# EAGLE board panda-2 (EAGLE 9.6.2)
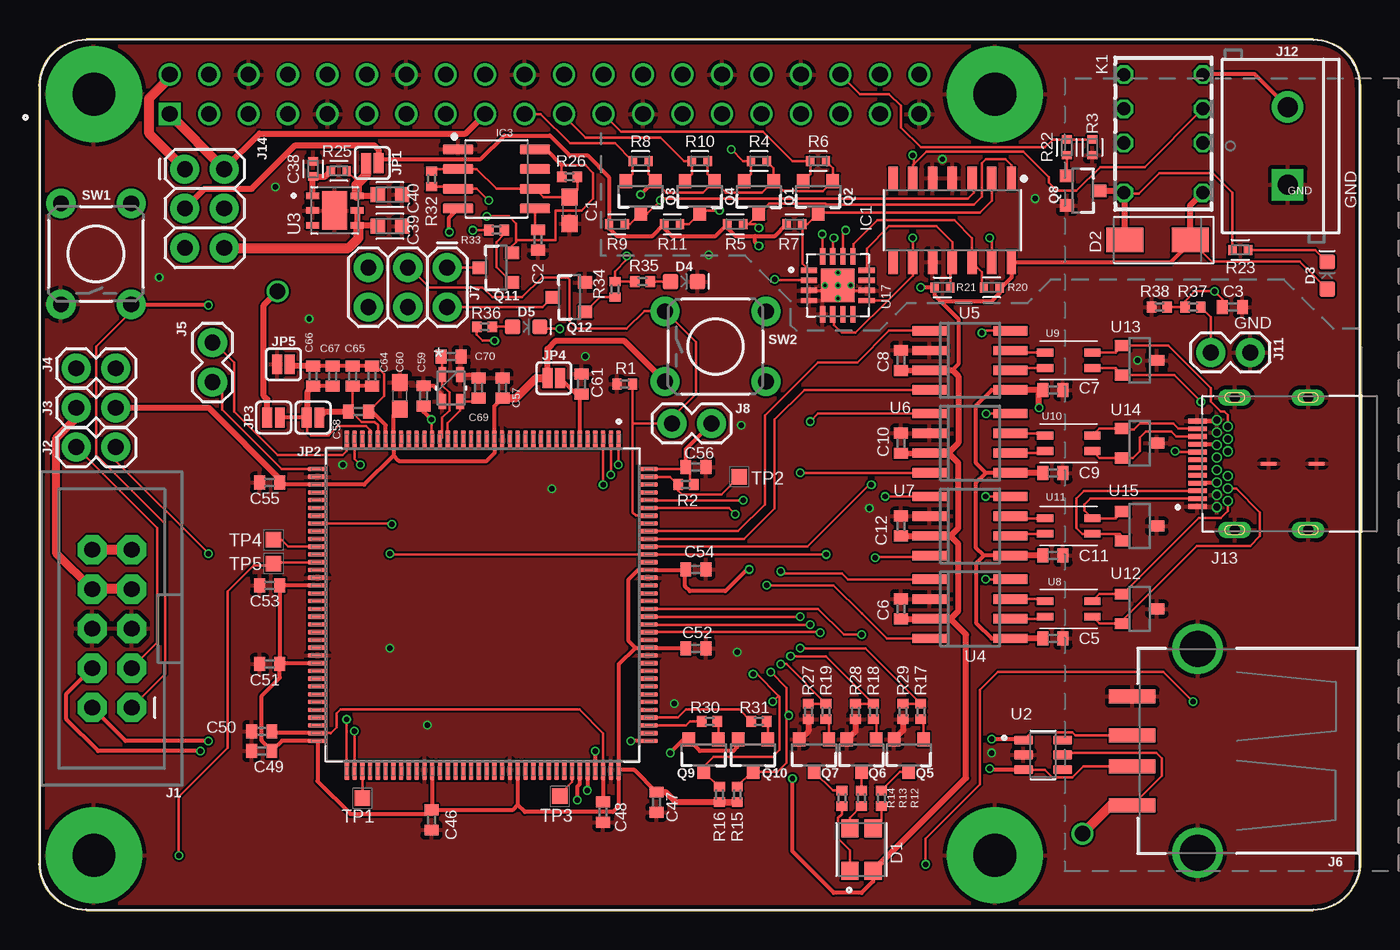
[diagram p3: board, top side]
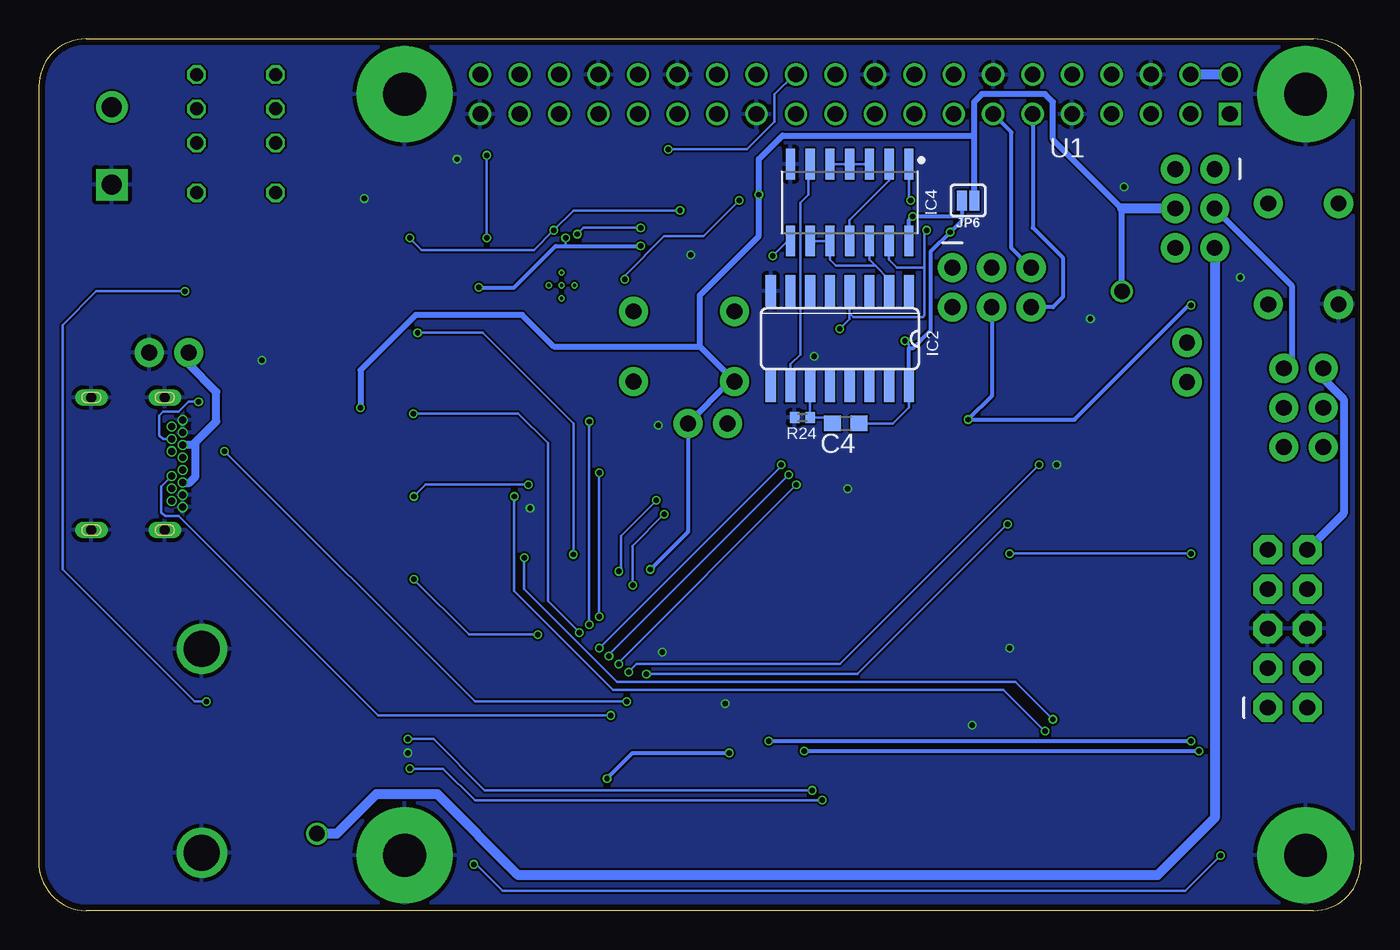
[diagram p4: board, bottom side, seen from below]

Size 85.09 x 56.13 mm. Coordinates in mm from the lower left corner, seen from the top.
Outline: 0,53.09 0,3.05 arc90 3.05,0 82.04,0 arc90 85.09,3.17 85.09,53.09 arc90 82.04,56.13 3.05,56.13 arc90 0,53.09
Copper layers (1*16): Top 0.035mm / dielectric 1.5mm / Bottom 0.035mm
Design rules "default *": minimum track width 6mil, minimum drill 0.1mm, track to track 5mil, track to pad 5mil, pad to pad 5mil, via to via 5mil, smd to smd 5mil, copper to edge 15mil, drill to drill 6mil, minimum pad ring 4mil, minimum via ring 4mil, stop-mask expansion 2mil, vias tented up to drill 0mil, thermal gap 10mil

## Footprints (pad centres in the part's own frame; a part is rotated, then mirrored left to right if it is on the bottom)
C0603 = smd 1.1 x 1: 1 -0.85,0; 2 0.85,0
C0402 = smd 0.7 x 0.9: 1 -0.65,0; 2 0.65,0
CAPC1005X60 = smd 0.56 x 0.629: 1 -0.485,0; 2 0.485,0
CAPC1608X85 = smd 0.921 x 0.97: 1 -0.775,0; 2 0.775,0
LED_CLV1A-FKB-CK1VW1DE1BB7C3C3 = smd 1.15 x 1.1: 1 -1.375,0.75; 2 -1.375,-0.75; 3 1.375,-0.75; 4 1.375,0.75
DIOM5226X290N = smd 2.392 x 1.565: 1 -2.108,0; 2 2.108,0
LED-0603 = smd 1 x 1: A -0.877,0; C 0.877,0
SOIC127P600X175-14N = smd 1.5 x 0.6: 1 -2.7,3.81; 2 -2.7,2.54; 3 -2.7,1.27; 4 -2.7,0; 5 -2.7,-1.27; 6 -2.7,-2.54; 7 -2.7,-3.81; 8 2.7,-3.81; 9 2.7,-2.54; 10 2.7,-1.27; 11 2.7,0; 12 2.7,1.27; 13 2.7,2.54; 14 2.7,3.81
SO16 = smd 0.66 x 2.032: 1 -4.445,-3.073; 2 -3.175,-3.073; 3 -1.905,-3.073; 4 -0.635,-3.073; 5 0.635,-3.073; 6 1.905,-3.073; 7 3.175,-3.073; 8 4.445,-3.073; 9 4.445,3.073; 10 3.175,3.073; 11 1.905,3.073; 12 0.635,3.073; 13 -0.635,3.073; 14 -1.905,3.073; 15 -3.175,3.073; 16 -4.445,3.073
SOIC127P599X175-8N = smd 1.965 x 0.602: 1 -2.47,1.905; 2 -2.47,0.635; 3 -2.47,-0.635; 4 -2.47,-1.905; 5 2.47,-1.905; 6 2.47,-0.635; 7 2.47,0.635; 8 2.47,1.905
SOIC127P600X175-14N' = smd 1.968 x 0.599: 1 -2.473,3.81; 2 -2.473,2.54; 3 -2.473,1.27; 4 -2.473,0; 5 -2.473,-1.27; 6 -2.473,-2.54; 7 -2.473,-3.81; 8 2.473,-3.81; 9 2.473,-2.54; 10 2.473,-1.27; 11 2.473,0; 12 2.473,1.27; 13 2.473,2.54; 14 2.473,3.81
2X5-SHROUDED-NS = drill 1.016 pad 1.88 octagon: 1 -1.27,5.08; 2 1.27,5.08; 3 -1.27,2.54; 4 1.27,2.54; 5 -1.27,0; 6 1.27,0; 7 -1.27,-2.54; 8 1.27,-2.54; 9 -1.27,-5.08; 10 1.27,-5.08
1X02 = drill 1.016 pad 1.88: 1 0,0; 2 2.54,0
USB-A-S-SILK-FEMALE = smd 3 x 0.9: D+ 7.212,-1; D- 7.212,1; GND 7.212,-3.5; VBUS 7.212,3.5 | drill 2.311: SHLD1 3,-6.566; SHLD2 3,6.566
2X3 = drill 1.016 pad 1.88: 1 0,0; 2 0,2.54; 3 2.54,0; 4 2.54,2.54; 5 5.08,0; 6 5.08,2.54
SCREWTERMINAL-5MM-2 = drill 1.3 pad 2.032 square: 1 0,0 | drill 1.3 pad 2.032: 2 5,0
BELFUSE_SS-52400-003 = smd 0.3 x 1.2: A1 -2.75,7.13; A2 -2.25,7.13; A3 -1.75,7.13; A4 -1.25,7.13; A5 -0.75,7.13; A6 -0.25,7.13; A7 0.25,7.13; A8 0.75,7.13; A9 1.25,7.13; A10 1.75,7.13; A11 2.25,7.13; A12 2.75,7.13 | drill 0.45 pad 0.65: B1 2.8,5.88; B2 2.4,5.17; B3 1.6,5.17; B4 1.2,5.88; B5 0.8,5.17; B6 0.4,5.88; B7 -0.4,5.88; B8 -0.8,5.17; B9 -1.2,5.88; B10 -1.6,5.17; B11 -2.4,5.17; B12 -2.8,5.88; G1 2,5.88; G2 -2,5.88 | smd 0.2 x 1: G3 0,2.55; G4 0,-0.55 | drill 0.65 pad 1.05 long: S1 -4.27,4.73; S2 4.27,4.73; S3 -4.27,0; S4 4.27,0
SMT-JUMPER_2_NC_PASTE_SILK = smd 0.635 x 1.27: 1 -0.406,0; 2 0.406,0
G6K-2P-Y = drill 0.85 octagon: 1 0,-2.54; 2 3.2,-2.54; 3 5.4,-2.54; 4 7.6,-2.54; 5 7.6,2.54; 6 5.4,2.54; 7 3.2,2.54; 8 0,2.54
SOT23-3 = smd 0.8 x 0.9: 1 -0.95,-1; 2 0.95,-1; 3 0,1.1
R0402 = smd 0.6 x 0.7: 1 -0.5,0; 2 0.5,0
RESC1005X40 = smd 0.535 x 0.644: 1 -0.507,0; 2 0.507,0
TACTILE_SWITCH_PTH_6.0MM = drill 1.016 pad 1.88: 1 -3.251,2.261; 2 3.251,2.261; 3 -3.251,-2.261; 4 3.251,-2.261
TESTPOINT_SMD-10SN = smd 1 x 1: TP 0,0
MODULE_RASPBERRYPI4_4GB = drill 1.016 square: 1 24.148,-1.256 | drill 1.016: 2 24.148,1.284; 3 21.608,-1.256; 4 21.608,1.284; 5 19.068,-1.256; 6 19.068,1.284; 7 16.528,-1.256; 8 16.528,1.284; 9 13.988,-1.256; 10 13.988,1.284; 11 11.448,-1.256; 12 11.448,1.284; 13 8.908,-1.256; 14 8.908,1.284; 15 6.368,-1.256; 16 6.368,1.284; 17 3.828,-1.256; 18 3.828,1.284; 19 1.288,-1.256; 20 1.288,1.284; 21 -1.252,-1.256; 22 -1.252,1.284; 23 -3.792,-1.256; 24 -3.792,1.284; 25 -6.332,-1.256; 26 -6.332,1.284; 27 -8.872,-1.256; 28 -8.872,1.284; 29 -11.412,-1.256; 30 -11.412,1.284; 31 -13.952,-1.256; 32 -13.952,1.284; 33 -16.492,-1.256; 34 -16.492,1.284; 35 -19.032,-1.256; 36 -19.032,1.284; 37 -21.572,-1.256; 38 -21.572,1.284; 39 -24.112,-1.256; 40 -24.112,1.284 | drill 2.75 pad 6.2: S1 29.018,0.014; S2 -28.982,0.014; S3 -28.982,-48.986; S4 29.018,-48.986
SOT95P280X145-6N = smd 1.21 x 0.58: 1 -1.255,0.95; 2 -1.255,0; 3 -1.255,-0.95; 4 1.255,-0.95; 5 1.255,0; 6 1.255,0.95
SON95P300X300X100-7N = smd 0.84 x 0.42: 1 -1.435,0.95; 2 -1.435,0; 3 -1.435,-0.95; 4 1.435,-0.95; 5 1.435,0; 6 1.435,0.95 | smd 1.6 x 2.5: 7 0,0
SOIC8 = smd 0.6 x 2.2: 1 -1.905,-2.6; 2 -0.635,-2.6; 3 0.635,-2.6; 4 1.905,-2.6; 5 1.905,2.6; 6 0.635,2.6; 7 -0.635,2.6; 8 -1.905,2.6
ACT1210-101-2P-TL = smd 1.05 x 0.5: 1 -1.525,0.5; 2 -1.525,-0.5; 3 1.525,-0.5; 4 1.525,0.5
DBZ_R-PDSO-G3 = smd 0.7 x 1: 1 -0.95,-1.1; 2 0.95,-1.1; 3 0,1.1
LQFP-144 = smd 1.26 x 0.3: 1 -10.63,8.75; 2 -10.63,8.25; 3 -10.63,7.75; 4 -10.63,7.25; 5 -10.63,6.75; 6 -10.63,6.25; 7 -10.63,5.75; 8 -10.63,5.25; 9 -10.63,4.75; 10 -10.63,4.25; 11 -10.63,3.75; 12 -10.63,3.25; 13 -10.63,2.75; 14 -10.63,2.25; 15 -10.63,1.75; 16 -10.63,1.25; 17 -10.63,0.75; 18 -10.63,0.25; 19 -10.63,-0.25; 20 -10.63,-0.75; 21 -10.63,-1.25; 22 -10.63,-1.75; 23 -10.63,-2.25; 24 -10.63,-2.75; 25 -10.63,-3.25; 26 -10.63,-3.75; 27 -10.63,-4.25; 28 -10.63,-4.75; 29 -10.63,-5.25; 30 -10.63,-5.75; 31 -10.63,-6.25; 32 -10.63,-6.75; 33 -10.63,-7.25; 34 -10.63,-7.75; 35 -10.63,-8.25; 36 -10.63,-8.75; 73 10.63,-8.75; 74 10.63,-8.25; 75 10.63,-7.75; 76 10.63,-7.25; 77 10.63,-6.75; 78 10.63,-6.25; 79 10.63,-5.75; 80 10.63,-5.25; 81 10.63,-4.75; 82 10.63,-4.25; 83 10.63,-3.75; 84 10.63,-3.25; 85 10.63,-2.75; 86 10.63,-2.25; 87 10.63,-1.75; 88 10.63,-1.25; 89 10.63,-0.75; 90 10.63,-0.25; 91 10.63,0.25; 92 10.63,0.75; 93 10.63,1.25; 94 10.63,1.75; 95 10.63,2.25; 96 10.63,2.75; 97 10.63,3.25; 98 10.63,3.75; 99 10.63,4.25; 100 10.63,4.75; 101 10.63,5.25; 102 10.63,5.75; 103 10.63,6.25; 104 10.63,6.75; 105 10.63,7.25; 106 10.63,7.75; 107 10.63,8.25; 108 10.63,8.75 | smd 0.3 x 1.26: 37 -8.75,-10.63; 38 -8.25,-10.63; 39 -7.75,-10.63; 40 -7.25,-10.63; 41 -6.75,-10.63; 42 -6.25,-10.63; 43 -5.75,-10.63; 44 -5.25,-10.63; 45 -4.75,-10.63; 46 -4.25,-10.63; 47 -3.75,-10.63; 48 -3.25,-10.63; 49 -2.75,-10.63; 50 -2.25,-10.63; 51 -1.75,-10.63; 52 -1.25,-10.63; 53 -0.75,-10.63; 54 -0.25,-10.63; 55 0.25,-10.63; 56 0.75,-10.63; 57 1.25,-10.63; 58 1.75,-10.63; 59 2.25,-10.63; 60 2.75,-10.63; 61 3.25,-10.63; 62 3.75,-10.63; 63 4.25,-10.63; 64 4.75,-10.63; 65 5.25,-10.63; 66 5.75,-10.63; 67 6.25,-10.63; 68 6.75,-10.63; 69 7.25,-10.63; 70 7.75,-10.63; 71 8.25,-10.63; 72 8.75,-10.63; 109 8.75,10.63; 110 8.25,10.63; 111 7.75,10.63; 112 7.25,10.63; 113 6.75,10.63; 114 6.25,10.63; 115 5.75,10.63; 116 5.25,10.63; 117 4.75,10.63; 118 4.25,10.63; 119 3.75,10.63; 120 3.25,10.63; 121 2.75,10.63; 122 2.25,10.63; 123 1.75,10.63; 124 1.25,10.63; 125 0.75,10.63; 126 0.25,10.63; 127 -0.25,10.63; 128 -0.75,10.63; 129 -1.25,10.63; 130 -1.75,10.63; 131 -2.25,10.63; 132 -2.75,10.63; 133 -3.25,10.63; 134 -3.75,10.63; 135 -4.25,10.63; 136 -4.75,10.63; 137 -5.25,10.63; 138 -5.75,10.63; 139 -6.25,10.63; 140 -6.75,10.63; 141 -7.25,10.63; 142 -7.75,10.63; 143 -8.25,10.63; 144 -8.75,10.63
QFN65P400X400X100-17N = smd 1.05 x 0.34: 1 -1.86,0.975; 2 -1.86,0.325; 3 -1.86,-0.325; 4 -1.86,-0.975; 9 1.86,-0.975; 10 1.86,-0.325; 11 1.86,0.325; 12 1.86,0.975 | smd 0.34 x 1.05: 5 -0.975,-1.86; 6 -0.325,-1.86; 7 0.325,-1.86; 8 0.975,-1.86; 13 0.975,1.86; 14 0.325,1.86; 15 -0.325,1.86; 16 -0.975,1.86 | smd 2.16 x 2.16: 17 0,0 | drill 0.2 pad 0.3: 18 0,0; 19 -0.83,0; 20 0.83,0; 21 0,0.83; 22 0,-0.83
NX2016SA_NDK = smd 0.508 x 0.965: 1 -0.572,0.876; 2 -0.572,-0.876; 3 0.572,-0.876; 4 0.572,0.876

## Placement (x,y rotation side)
C1  4.7uF  [C0603]  34.16,45.09 270 top
C2  100nF  [C0402]  32.13,43.18 270 top
C3  1uF  [C0402]  76.83,38.86 0 top
C4  4.7uF  [C0603]  33.15,31.37 180 bottom
C5  0.1uF  [C0402]  65.28,17.53 0 top
C6  0.1uF  [C0402]  55.5,19.43 90 top
C7  0.1uF  [C0402]  65.28,33.53 0 top
C8  0.1uF  [C0402]  55.5,35.43 90 top
C9  0.1uF  [C0402]  65.28,28.19 0 top
C10  0.1uF  [C0402]  55.5,30.1 90 top
C11  0.1uF  [C0402]  65.28,22.86 0 top
C12  0.1uF  [C0402]  55.5,24.77 90 top
C38  100nF  [CAPC1005X60]  17.65,47.75 90 top
C39  4.7uF  [CAPC1608X85]  22.61,44.07 0 top
C40  4.7uF  [CAPC1608X85]  22.61,46.1 0 top
C46  100nF  [C0402]  25.27,5.84 270 top
C47  100nF  [C0402]  39.75,6.98 270 top
C48  1uF  [C0402]  36.32,6.35 270 top
C49  100nF  [C0402]  14.35,10.29 180 top
C50  1uF  [C0402]  14.35,11.56 180 top
C51  100nF  [C0402]  14.86,15.88 180 top
C52  100nF  [C0402]  42.29,16.89 0 top
C53  100nF  [C0402]  14.86,20.95 180 top
C54  100nF  [C0402]  42.29,21.97 0 top
C55  100nF  [C0402]  14.86,27.56 180 top
C56  100nF  [C0402]  42.29,28.58 0 top
C57  100nF  [C0402]  29.84,33.66 90 top
C58  100nF  [C0402]  20.57,32.13 0 top
C59  100nF  [C0402]  24.77,33.15 90 top
C60  4.7uF  [C0603]  23.24,33.15 90 top
C61  1uF  [C0402]  34.92,33.91 90 top
C64  1uF  [C0402]  21.46,34.42 90 top
C65  100nF  [C0402]  20.19,34.42 90 top
C66  1uF  [C0402]  17.65,34.42 90 top
C67  100nF  [C0402]  18.92,34.42 90 top
C69  5.6p  [C0402]  28.32,33.66 90 top
C70  5.6p  [C0402]  26.54,35.69 0 top
D1  CLV1A-FKB-CK1VW1DE1BB7C3C3  [LED_CLV1A-FKB-CK1VW1DE1BB7C3C3]  52.96,3.94 90 top
D2  MRA4003T3G  [DIOM5226X290N]  72.01,43.18 180 top
D3  ACC_EN  [LED-0603]  82.93,40.89 90 top
D4  RST  [LED-0603]  41.53,40.51 0 top
D5  BOOT  [LED-0603]  31.37,37.59 0 top
IC1  MCP4261-103E/SL  [SOIC127P600X175-14N]  58.8,44.45 270 top
IC2  4040D  [SO16]  33.53,36.83 180 bottom
IC3  LMC555_SOIC  [SOIC127P599X175-8N]  29.46,47.12 0 top
IC4  74HC00_SOIC  [SOIC127P600X175-14N']  32.89,45.59 270 bottom
J1  ST-Link  [2X5-SHROUDED-NS]  4.7,18.16 180 top
J2  SWIM  [1X02]  2.41,29.84 0 top
J3  ST_3.3V  [1X02]  2.41,32.38 0 top
J4  ST_5V  [1X02]  2.41,34.92 0 top
J5  USART2  [1X02]  11.18,34.04 90 top
J6  USB_A_SMT_FEMALE  [USB-A-S-SILK-FEMALE]  77.6,10.29 180 top
J7  Startup Hacks  [2X3]  26.29,41.4 180 top
J8  Boot  [1X02]  43.31,31.37 180 top
J11  VIN  [1X02]  77.98,35.94 180 top
J12  ACC  [SCREWTERMINAL-5MM-2]  80.39,46.74 90 top
J13  SS-52400-003  [BELFUSE_SS-52400-003]  81.71,28.78 90 top
J14  Power Select  [2X3]  9.4,47.75 270 top
JP1  5V for 3v3 Reg  [SMT-JUMPER_2_NC_PASTE_SILK]  21.46,48.13 0 top
JP2  VREF+  [SMT-JUMPER_2_NC_PASTE_SILK]  17.65,31.75 0 top
JP3  VDDA  [SMT-JUMPER_2_NC_PASTE_SILK]  15.11,31.75 0 top
JP4  VBAT  [SMT-JUMPER_2_NC_PASTE_SILK]  33.15,34.29 0 top
JP5  AGND  [SMT-JUMPER_2_NC_PASTE_SILK]  15.75,35.18 0 top
JP6  VHAX  [SMT-JUMPER_2_NC_PASTE_SILK]  25.27,45.72 180 bottom
K1  G6K-2P-Y  [G6K-2P-Y]  72.39,46.23 90 top
Q1  220mA/50V/3.5Ω  [SOT23-3]  46.35,45.97 180 top
Q2  220mA/50V/3.5Ω  [SOT23-3]  50.16,45.97 180 top
Q3  220mA/50V/3.5Ω  [SOT23-3]  38.73,45.97 180 top
Q4  220mA/50V/3.5Ω  [SOT23-3]  42.55,45.97 180 top
Q5  220mA/50V/3.5Ω  [SOT23-3]  56.01,10.03 180 top
Q6  220mA/50V/3.5Ω  [SOT23-3]  52.96,10.03 180 top
Q7  220mA/50V/3.5Ω  [SOT23-3]  49.91,10.03 180 top
Q8  220mA/50V/3.5Ω  [SOT23-3]  67.18,46.35 270 top
Q9  200mA/40V  [SOT23-3]  42.8,10.03 180 top
Q10  200mA/40V  [SOT23-3]  45.97,10.03 180 top
Q11  200mA/40V  [SOT23-3]  29.46,41.4 90 top
Q12  220mA/50V/3.5Ω  [SOT23-3]  34.16,39.5 90 top
R1  10k  [R0402]  37.72,33.91 0 top
R2  10k  [R0402]  41.66,27.43 0 top
R3  10k  [RESC1005X40]  67.82,49.15 90 top
R4  10k  [RESC1005X40]  46.35,48.26 0 top
R5  10k  [RESC1005X40]  44.83,44.2 180 top
R6  10k  [RESC1005X40]  50.16,48.26 0 top
R7  10k  [RESC1005X40]  48.64,44.2 180 top
R8  10k  [RESC1005X40]  38.73,48.26 0 top
R9  10k  [RESC1005X40]  37.21,44.2 180 top
R10  10k  [RESC1005X40]  42.55,48.26 0 top
R11  10k  [RESC1005X40]  40.77,44.2 180 top
R12  360  [R0402]  54.23,7.24 90 top
R13  360  [R0402]  52.96,7.24 90 top
R14  560  [R0402]  51.69,7.24 90 top
R15  10k  [R0402]  44.96,7.49 270 top
R16  10k  [R0402]  43.81,7.49 270 top
R17  100  [R0402]  56.77,12.83 90 top
R18  100  [R0402]  53.72,12.83 90 top
R19  100  [R0402]  50.67,12.83 90 top
R20  10k  [RESC1005X40]  61.34,40.13 0 top
R21  10k  [RESC1005X40]  58.17,40.13 180 top
R22  100  [RESC1005X40]  66.17,49.15 90 top
R23  220  [RESC1005X40]  77.34,42.55 180 top
R24  10k  [R0402]  35.94,31.75 0 bottom
R25  10k  [RESC1005X40]  19.3,47.62 0 top
R26  DNP  [R0402]  34.16,47.24 180 top
R27  10k  [R0402]  49.53,12.83 90 top
R28  10k  [R0402]  52.58,12.83 90 top
R29  10k  [R0402]  55.63,12.83 90 top
R30  560  [R0402]  43.18,12.19 180 top
R31  560  [R0402]  46.35,12.19 180 top
R32  2.4k  [R0402]  25.27,47.12 90 top
R33  560  [R0402]  29.46,43.81 180 top
R34  100  [R0402]  37.08,40 90 top
R35  220  [R0402]  38.86,40.51 0 top
R36  220  [R0402]  28.7,37.59 0 top
R37  10k  [R0402]  74.3,38.86 0 top
R38  1k  [R0402]  72.14,38.86 0 top
SW1  Reset  [TACTILE_SWITCH_PTH_6.0MM]  3.68,42.29 90 top
SW2  Boot  [TACTILE_SWITCH_PTH_6.0MM]  43.56,36.32 0 top
TP1  USB_LOAD_SWITCH  [TESTPOINT_SMD-10SN]  20.83,7.24 0 top
TP2  PDR_ON  [TESTPOINT_SMD-10SN]  45.09,27.94 0 top
TP3  USB_ID  [TESTPOINT_SMD-10SN]  33.53,7.37 0 top
TP4  5VOUT_S  [TESTPOINT_SMD-10SN]  15.11,23.88 0 top
TP5  VOLT_S  [TESTPOINT_SMD-10SN]  15.11,22.35 0 top
U1  RASPBERRYPI4_4GB  [MODULE_RASPBERRYPI4_4GB]  32.56,52.55 0 bottom
U2  USBLC6-4SC6Y  [SOT95P280X145-6N]  64.64,10.03 0 top
U3  ST1L05CPU33R  [SON95P300X300X100-7N]  19.05,45.09 0 top
U4  TLE9251VSJXUMA1  [SOIC8]  59.94,19.43 270 top
U5  TLE9251VSJXUMA1  [SOIC8]  59.94,35.43 270 top
U6  TLE9251VSJXUMA1  [SOIC8]  59.94,30.1 270 top
U7  TLE9251VSJXUMA1  [SOIC8]  59.94,24.77 270 top
U8  ACT1210D  [ACT1210-101-2P-TL]  66.29,19.43 0 top
U9  ACT1210D  [ACT1210-101-2P-TL]  66.29,35.43 0 top
U10  ACT1210D  [ACT1210-101-2P-TL]  66.29,30.1 0 top
U11  ACT1210D  [ACT1210-101-2P-TL]  66.29,24.77 0 top
U12  PESD2CANFD27V-T  [DBZ_R-PDSO-G3]  70.87,19.43 270 top
U13  PESD2CANFD27V-T  [DBZ_R-PDSO-G3]  70.87,35.43 270 top
U14  PESD2CANFD27V-T  [DBZ_R-PDSO-G3]  70.87,30.1 270 top
U15  PESD2CANFD27V-T  [DBZ_R-PDSO-G3]  70.87,24.77 270 top
U16  STM32H723ZGT  [LQFP-144]  28.57,19.69 270 top
U17  MCP4261-103E/ML  [QFN65P400X400X100-17N]  51.44,40.26 0 top
X1  NX2016SA-32MHZ-EXS00A-CS06654  [NX2016SA_NDK]  26.54,33.66 0 top

## Tracks (layer width: path | path; a pad name or v marks a point on that pad's centre or on a via)
3V3_BRD
  Top 0.381: C39.1 21.77,44.13 U3.4 U3.5
  Top 0.635: J14.6 19.94,42.67 20.57,43.31 20.57,44.05 U3.4
3V3_PI
  Top 0.381: 11.94,47.77 14.2,50.04 27.48,50.04 U1.17
  Top 0.635: 11.94,47.77 J14.2 8.41,51.27 U1.1
5V_PI
  Top 0.635: J14.1 7.11,50.04 7.11,52.32 8.41,53.63 U1.2
  Bottom 0.635: U1.2 U1.4
5V_USB  (via drill 1)
  Top 0.152: U2.5 66.03,10.16 71.94,10.16 72.28,9.82 72.28,8.69 70.39,6.8 J6.VBUS
  Top 0.635: v67.18,4.95 69.02,6.79 J6.VBUS
  Bottom 0.635: J14.5 9.4,5.97 13.08,2.29 54.23,2.29 59.44,7.49 63.37,7.49 65.91,4.95 v67.18,4.95
5VOLT_S
  Top 0.152: U16.47 16.06,23.44 15.62,23.88 TP4.TP
!CLK_4040
  Bottom 0.152: IC4.3 IC4.4 IC4.5
!DONE
  Bottom 0.152: IC4.2 30.35,46.99 32.89,44.45 IC4.11
!RST_DRIVE
  Bottom 0.152: IC2.2 30.35,40.64 31.24,41.53 | IC4.9 IC4.10 34.16,41.91 33.78,41.53 31.24,41.53 | IC4.12 31.62,41.91 31.24,41.53
+3V3  (via drill 0.35, 1)
  Top 0.152: 41.5,28.44 U16.144 | R8.2 39.24,47.42 Q3.1 40.39,46.27 40.39,46.23 42.75,46.23 Q4.1 | R10.2 43.05,47.42 Q4.1 | R4.2 47.3,47.82 Q1.1 | R6.2 51.12,47.82 Q2.1 50.46,46.32 48.73,46.32 48.7,46.35 47.92,46.35 Q1.1 | Q4.1 44.2,46.27 44.2,46.23 46.56,46.23 Q1.1 | R2.2 41.91,27.68 41.91,28.19 41.59,28.52
  Top 0.254: C57.1 29.32,32.48 U16.17 29.32,29.45 28.83,28.96 23.17,28.96 22.82,29.3 | 41.6,21.94 U16.131 38.57,21.94 37.97,21.34 37.97,17.36 38.4,16.94 | 41.6,21.94 C54.1 | C52.1 41.6,16.94 U16.121 38.4,16.94 | C47.1 38.33,9.05 U16.108 | U16.52 15.53,20.94 C53.1 C51.1 | U16.39 17.91,27.44 | 17.91,27.44 15.63,27.44 C55.1 | U16.62 15.57,15.94 C51.1 | C51.1 15.51,15 14.35,13.84 14.35,10.94 C49.1 15.65,10.94 U16.72 17.95,8.34 20.07,6.22 25.32,6.22 25.32,6.54 | U16.84 25.32,6.54 | 25.32,6.54 C46.1 25.29,6.48 30.48,6.48 30.82,6.82 | U16.95 30.82,6.82 | U16.108 37.33,6.72 36.96,6.35 31.3,6.35 30.82,6.82 | U16.108 37.34,9.07 37.34,15.88 38.4,16.94 | 22.82,29.3 U16.30 22.82,31.88 C60.1 | 22.82,29.3 20.95,27.43 17.91,27.43 17.91,27.44 | 62.99,17.53 61.34,17.53 60.33,18.54 60.33,22.35 60.83,22.86 | v38.73,46.1 39.61,46.97 Q3.1 | 41.5,28.44 41.59,28.52 C56.1 41.66,28.59 41.66,29.72 J8.1 | U7.5 60.83,22.86 | 60.83,22.86 60.33,23.37 60.33,27.56 60.96,28.19 | U6.5 60.96,28.19 | 60.96,28.19 60.33,28.83 60.33,32.51 61.34,33.53 62.74,33.53 | v45.72,21.97 45.59,21.97 44.2,20.57 41.91,20.57 41.6,20.88 41.6,21.94
  Top 0.381: C11.1 U7.5 | C5.1 62.99,17.53 U4.5 | U5.5 62.74,33.53 C7.1 64.39,33.29 v64.39,32.38 | C9.1 U6.5 | R16.2 R15.2 41.01,6.99 40.37,7.63 C47.1 | J3.2 10.92,32.38 15.63,27.67 15.63,27.44 | JP3.1 14.71,32.92 14.48,33.15 14.48,38.99 v15.37,39.88 | JP4.1 32.74,36.17 33.27,36.7 37.67,36.7 SW2.3
  Top 0.508: C57.1 30.72,33 32,34.29 JP4.1
  Bottom 0.254: v45.72,21.97 43.31,24.38 J8.1
  Bottom 0.381: 42.55,36.32 51.94,36.32 53.98,38.35 60.83,38.35 64.39,34.8 v64.39,32.38 | 40.31,34.09 42.55,36.32 | 40.31,34.09 SW2.3 | v15.37,39.88 15.37,45.21 19.81,49.66 19.81,52.07 20.32,52.58 24.38,52.58 24.89,52.07 24.89,49.78 | 42.55,36.32 42.55,39.62 38.73,43.43 v38.73,46.1 38.73,48.39 37.21,49.91 25.02,49.91 24.89,49.78 | J8.1 40.59,34.09 40.31,34.09 | JP6.1 24.89,45.74 24.89,49.78
  Bottom 0.635: J14.4 15.37,45.21
+5V  (via drill 0.35)
  Top 0.152: D3.A 81.17,41.78 75.51,41.78 74.21,43.09 D2.1 | U17.15 51.11,43.24 v51.18,43.31
  Top 0.254: 46.1,43.43 44.83,43.43 44.32,43.94 R5.2 43.56,43.43 40.77,43.43 40.26,43.94 R11.2 39.5,43.43 37.21,43.43 36.7,43.94 R9.2 36.7,47.24 35.31,48.64 34.16,48.64 32.89,49.91 29.97,49.91 28.45,48.39 22.12,48.39 JP1.2 | 46.1,43.43 47.37,43.43 R7.2 | 74.21,43.09 72.86,41.75 IC1.14 62.61,40.77 61.98,40.13 R20.2 61.85,39.75 61.34,39.24 58.04,39.24 | v56.77,40.13 R21.2 57.66,39.62 58.04,39.24 | v46.35,42.8 46.1,43.05 46.1,43.43 | Q10.2 44.96,10.97 44.96,10.54 44.7,10.29 42.55,10.29 41.85,10.98 | 41.85,10.98 Q9.2 | 58.04,39.24 59.18,38.1 59.18,35.18 58.8,34.8 | D1.2 53.71,1.89 52.96,1.14 51.18,1.14 48.51,3.81 v48.51,8.51 | v40.64,10.16 41.46,10.98 41.85,10.98
  Top 0.381: D2.1 74.12,45.41 K1.1 | C10.1 U6.3 58.55,29.46 | C8.1 U5.3 58.8,34.8 59.18,34.42 59.18,30.1 58.55,29.46 | C6.1 U4.3 58.67,18.8 | C12.1 U7.3 58.67,24.13 | J14.3 10.67,46.48 13.72,46.48 16.51,49.28 21.59,49.28 21.87,49 JP1.2 | D1.2 59.69,8.54 59.69,17.78 58.67,18.8 | 58.67,18.8 59.18,19.3 59.18,23.62 58.67,24.13 | 58.67,24.13 59.18,24.64 59.18,28.83 58.55,29.46
  Bottom 0.152: v51.18,43.31 51.18,42.8
  Bottom 0.254: v56.77,40.13 54.48,40.13 51.82,42.8 51.18,42.8 v46.35,42.8 | v48.51,8.51 46.86,10.16 v40.64,10.16
  Bottom 0.381: J14.3 4.44,40.26 4.44,35.43 J4.2
AGND
  Top 0.152: C64.2 21.7,35.07 22.23,34.54 22.23,33.13 C58.2
  Top 0.254: U16.31 22.32,31.27 21.46,32.13 C58.2 | C64.2 C65.2 C67.2 C66.2
  Top 0.381: C66.2 16.27,35.07 JP5.2
BOARD_BOOT0
  Top 0.152: Q11.3 J7.1
BOARD_NRST
  Top 0.152: Q12.3 32.43,38.86 J7.2
BOOT0
  Top 0.152: U16.138 38.45,25.44 38.23,25.65 38.23,31.37 | 38.23,33.66 38.23,31.37 | J7.3 23.88,41.4 25.15,40.13 28.57,40.13 29.21,39.5 31.11,39.5 32.38,40.77 34.04,40.77 34.16,40.64 34.16,37.97 34.67,37.46 37.85,37.46 38.99,38.61 40.28,38.61 SW2.1 40.34,38.56 42.29,36.6 42.29,33.27 40.77,31.75 J8.2 38.23,31.37
  Top 0.254: R1.2 38.23,33.66
BOOT_DRIVE  (via drill 0.35)
  Top 0.152: R33.2 v27.94,43.81 | D5.C 32.37,37.46 v33.53,37.46
  Bottom 0.152: v27.94,43.81 28.07,43.69 28.07,41.4 | 28.07,41.4 28.07,38.35 28.19,38.23 32.64,38.23 32.89,38.48 | 32.89,38.48 IC2.4 | v33.53,37.46 32.89,38.1 32.89,38.48 | IC4.13 30.35,41.91 29.84,41.4 28.07,41.4
CAN0_H
  Top 0.152: U8.4 68.27,20.38 U12.1 74.66,25.27 76.07,25.27 76.54,25.74 J13.B11
CAN0_L
  Top 0.152: U8.3 68.27,18.48 U12.2 69.77,18.71 74.55,23.49 77.98,23.49 78.61,24.13 78.61,25.65 77.09,27.18 J13.B10
CAN1_H
  Top 0.152: U9.4 69.32,35.93 U13.1 72.71,36.38 75.44,33.66 75.44,32.77 76.07,32.13 76.33,32.13 76.54,31.92 J13.B2
CAN1_L  (via drill 0.35)
  Top 0.152: U9.3 69.33,34.93 U13.2 73.09,34.48 v74.8,32.77
  Bottom 0.152: v74.8,32.77 75.44,32.77 76.07,32.13 77.09,32.13 77.34,31.88 77.34,30.61 77.09,30.35 76.57,30.35 J13.B3
CAN2_H
  Top 0.152: U10.4 68.27,31.05 U14.1 69.83,30.99 70.48,30.99 70.87,31.37 73.03,31.37 73.37,31.03 J13.A11
CAN2_L
  Top 0.152: U10.3 68.27,29.15 U14.2 70.42,29.15 70.87,29.59 70.87,30.48 71.25,30.86 72.9,30.86 73.23,30.53 J13.A10
CAN3_H
  Top 0.152: U15.1 69.32,25.27 U11.4 67.31,25.77 67.31,26.16 67.68,26.53 J13.A2
CAN3_L
  Top 0.152: U15.2 69.9,23.95 69.59,24.27 U11.3 67.18,24.26 66.8,24.64 66.8,26.54 67.29,27.03 J13.A3
CAN_RXD_1  (via drill 0.35)
  Top 0.152: U16.139 44.42,25.94 v44.83,25.53 | v46.86,20.95 51.17,20.95 52.97,19.15 52.98,19.15 54.61,17.53 U4.4
  Bottom 0.152: v44.83,25.53 46.86,23.49 v46.86,20.95
CAN_RXD_2
  Top 0.152: U5.4 49.28,33.53 47.37,31.62 47.37,25.91 45.4,23.94 U16.135
CAN_RXD_3  (via drill 0.35)
  Top 0.152: U16.125 v49.02,18.92 | v49.02,28.19 U6.4
  Bottom 0.152: v49.02,18.92 v49.02,28.19
CAN_RXD_4  (via drill 0.35)
  Top 0.152: v53.85,22.73 53.88,22.76 57.24,22.76 U7.4 | v19.81,12.32 19.82,12.31 U16.73
  Bottom 0.152: v53.85,22.73 53.85,20.7 47.88,14.73 22.23,14.73 v19.81,12.32
CAN_STBY_1  (via drill 0.35)
  Top 0.152: v60.96,21.34 U4.8 | v52.96,17.78 51.82,17.78 50.16,19.44 U16.126
  Bottom 0.152: v60.96,21.34 57.4,17.78 v52.96,17.78
CAN_STBY_2  (via drill 0.35)
  Top 0.152: v50.67,22.94 U16.133 22.66,22.94 v22.61,22.99 | v10.92,22.99 4.95,28.96 J2.2 | U5.8 60.83,37.34 v60.71,37.21
  Bottom 0.152: v22.61,22.99 v10.92,22.99 | v60.71,37.21 56.52,37.21 50.67,31.37 v50.67,22.94
CAN_STBY_3  (via drill 0.35)
  Top 0.152: U16.123 50.26,17.94 v50.29,17.91 | U6.8 v60.98,32
  Bottom 0.152: v50.29,17.91 52.32,19.94 52.32,30.1 54.23,32 v60.98,32
CAN_STBY_4  (via drill 0.35)
  Top 0.152: U16.134 49.47,23.44 53.47,27.43 v53.59,27.43 | v60.96,26.67 U7.8
  Bottom 0.152: v53.59,27.43 60.2,27.43 v60.96,26.67
CAN_TXD_1  (via drill 0.35)
  Top 0.152: U4.1 52.07,21.34 51.69,21.72 47.88,21.72 v47.75,21.84 | v45.34,26.42 39.22,26.42 U16.140
  Bottom 0.152: v47.75,21.84 47.62,21.97 47.62,24.13 v45.34,26.42
CAN_TXD_2
  Top 0.152: U16.136 45.01,24.44 46.74,26.16 46.74,31.88 50.16,35.31 52.7,35.31 54.74,37.34 U5.1
CAN_TXD_3  (via drill 0.35)
  Top 0.152: v49.66,18.41 39.23,18.41 U16.124 | U6.1 50.16,32 v49.66,31.5
  Bottom 0.152: v49.66,18.41 v49.66,31.5
CAN_TXD_4  (via drill 0.35)
  Top 0.152: v20.32,11.56 v20.32,11.55 U16.74 | U7.1 v54.48,26.67
  Bottom 0.152: v54.48,26.67 54.48,20.57 48.13,14.22 22.99,14.22 v20.32,11.56
CLK_555  (via drill 0.35)
  Top 0.152: v28.96,45.72 28.19,46.48 IC3.3 26.86,46.62 R32.1
  Bottom 0.152: IC4.1 29.08,45.85 v28.96,45.72
CLK_4040
  Bottom 0.152: IC2.10 36.7,35.18 36.07,35.81 36.07,45.59 35.56,46.1 35.56,47.94 IC4.6
CNT_RST
  Bottom 0.152: IC2.11 35.44,33.75 R24.2 34.38,31.75 C4.2
GND  (via drill 0.35)
  Top 0.152: U17.3 50.36,39.93 50.44,39.85 50.77,39.85 51.01,40.09 51.01,40.24 51.03,40.26 51.03,40.43 51.27,40.66 51.6,40.66 51.86,40.41 51.86,40.09 | 51.86,40.09 52.1,39.85 52.43,39.85 52.51,39.93 U17.10 | U17.17 51.69,40.26 51.86,40.09
  Top 0.254: J13.A12 75.78,31.53 J13.B1 | C59.2 25.38,33.8 25.97,33.21 X1.2 | X1.4 28.09,34.53 C69.2
  Top 0.381: R27.1 49.53,11.56 49.01,11.03 Q7.2 | Q5.2 55.63,11.6 R29.1 | R28.1 52.58,11.56 52.05,11.03 Q6.2
  other vias: 70.74,35.43 58.17,48.39 33.02,27.18 22.61,16.89 40.89,13.33 35.18,35.69 17.4,38.1 44.96,16.64 53.47,25.91 15.24,46.61 7.75,40.77 43.12,42.23 45.21,31.24 25.02,11.94 64.14,45.85 19.56,28.7 61.34,10.16
  pour Top: 0.51,56.01 84.71,56.01 84.71,0.25 0.38,0.25 0.38,55.88
  pour Bottom: 0.38,56.01 84.71,56.01 84.71,0.25 0.38,0.25
LED_BLUE  (via drill 0.35)
  Top 0.152: U16.1 37.31,30.3 v37.31,28.7 | v49.02,16.89 53.2,16.89 R17.2 R29.2
  Bottom 0.152: v49.02,16.89 37.31,28.6 v37.31,28.7
LED_GREEN  (via drill 0.35)
  Top 0.152: U16.2 v36.83,28.07 | v48.39,16.38 50.66,16.38 R18.2 R28.2
  Bottom 0.152: v36.83,28.07 48.39,16.51 v48.39,16.38
LED_RED  (via drill 0.35)
  Top 0.152: U16.3 v36.33,27.44 v36.32,27.43 | v47.75,15.88 48.12,15.88 R19.2 R27.2
  Bottom 0.152: v36.32,27.43 47.75,16 v47.75,15.88
N$1
  Top 0.152: U4.7 64.63,20.07 U8.1
N$2
  Top 0.152: U8.2 64.63,18.8 U4.6
N$3
  Top 0.152: U9.1 62.68,35.93 U5.7
N$4
  Top 0.152: U5.6 62.68,34.93 U9.2
N$5
  Top 0.152: U6.7 64.63,30.73 U10.1
N$6
  Top 0.152: U10.2 64.63,29.46 U6.6
N$7
  Top 0.152: U11.1 62.68,25.27 U7.7
N$8
  Top 0.152: U7.6 62.68,24.27 U11.2
N$9
  Top 0.508: J3.1 2.41,31.71 1.09,30.39 1.09,23.04 J1.8
  Top 0.635: J1.7 J1.8
N$10
  Top 0.254: J12.2 78.28,53.85 74.95,53.85 K1.4
N$11
  Top 0.635: J1.9 J1.10
  Bottom 0.508: J4.1 2.41,34.25 1.09,32.93 1.09,25.58 J1.10
N$12
  Top 0.152: R12.2 55.42,8.93 Q5.3
N$13
  Top 0.152: D1.3 54.23,5.83 R12.1
N$14
  Top 0.152: D1.4 52.21,5.99 R13.1
N$15
  Top 0.152: D1.1 52.21,3.9 51.46,4.65 51.46,5.97 51.69,6.2 R14.1
N$16
  Top 0.152: R13.2 Q6.3
N$17
  Top 0.152: R14.2 51.1,7.74 Q7.3
N$18
  Top 0.152: R30.1 43.75,12.12 Q9.1
N$19
  Top 0.152: Q5.1 56.96,12.14 R17.1
N$20
  Top 0.152: Q6.1 53.91,12.14 R18.1
N$21
  Top 0.152: Q7.1 50.86,12.14 R19.1
N$22
  Top 0.152: R35.2 D4.A
N$23
  Top 0.152: R36.2 D5.A
N$24
  Top 0.152: R23.1 82.16,42.55 D3.C
N$25
  Top 0.152: R23.2 76.83,46.23 75.56,47.5 72.14,47.5 70.81,46.18 69.9,46.18
  Top 0.381: D2.2 69.9,46.18 K1.8 69.72,46.35 Q8.3
N$26
  Top 0.152: R22.1 66.18,48.62 Q8.1
N$27
  Top 0.381: U3.1 17.61,47.23 C38.1 18.44,47.27 R25.1
N$28
  Top 0.152: R25.2 20.45,46.99 20.45,46.74
  Top 0.381: U3.6 21.77,46.03 C40.1
  Top 0.635: JP1.1 21.06,47.35 20.45,46.74 20.45,46.07 U3.6
N$29
  Top 0.152: U16.36 19.82,29.6 19.56,29.34 15.37,29.34 12.57,32.13 12.57,35.31 11.3,36.58 J5.2
N$30
  Top 0.152: J5.1 11.81,33.4 11.81,32.26 15.63,28.44 U16.37
N$31
  Top 0.152: R31.1 46.92,12.12 Q10.1
N$35
  Top 0.152: R26.1 34.66,46.43 C1.1 32.48,45.93 IC3.6 29.46,46.48 28.19,47.75 IC3.2 25.41,47.75 R32.2
N$37
  Top 0.152: C2.1 31.93,44.03 IC3.5
N$44
  Top 0.152: R33.1 29.96,43.55 29.46,43.05 29.46,41.45 Q11.1
N$45
  Top 0.152: Q12.1 36.12,39.5 R34.1
NRST  (via drill 0.35)
  Top 0.152: U16.25 25.27,30.37 v25.27,31.62 | J1.1 8.13,15.24 8.13,24.89 3.68,29.34 3.68,36.32 6.35,38.99
  Top 0.254: C59.1 24.77,32.13 v25.27,31.62 | v10.92,38.99 6.35,38.99 5.99,38.99 SW1.3
  Bottom 0.254: v10.92,38.99 11.05,38.99 18.41,31.62 v25.27,31.62 23.75,33.15 J7.4
OBD_SBU1  (via drill 0.35)
  Top 0.152: J13.A8 73.22,29.53 v73.15,29.59 | U16.44 22.69,24.94 v22.73,24.89 | R16.1 43.74,7.99 42.82,8.91 | 42.82,8.91 Q9.3 | v45.97,15.24 46.23,15.24 47.62,13.84 | 47.62,13.84 47.69,13.78 47.69,10.35 47.24,9.91 43.43,9.91 42.82,9.29 42.82,8.91 | v47.24,13.46 47.62,13.84
  Bottom 0.152: v22.73,24.89 32.38,15.24 v45.97,15.24 | v73.15,29.59 57.02,13.46 v47.24,13.46
OBD_SBU1_RELAY
  Top 0.152: U16.111 41.66,11.94 41.91,12.19 R30.2
OBD_SBU2  (via drill 0.35)
  Top 0.152: U16.35 20.32,29.08 v20.7,28.7 | R15.1 45.9,8.93 Q10.3 47.54,8.93 48.13,9.53 48.13,12.45 v48.26,12.57 48.13,12.7 48.13,14.35 v47.12,15.37
  Bottom 0.152: J13.B8 77.22,27.3 77.22,25.65 76.96,25.4 76.07,25.4 63.25,12.57 v48.26,12.57 | v20.7,28.7 33.53,15.88 46.61,15.88 v47.12,15.37
OBD_SBU2_RELAY
  Top 0.152: U16.112 41.14,12.44 41.66,12.95 45.09,12.95 R31.2
PDR
  Top 0.152: U16.143 40.65,27.94 R2.1 41.16,27.04 41.4,26.8 43.94,26.8 TP2.TP
PH0-OSC_IN
  Top 0.152: U16.23 26.32,31.41 27.11,32.19 X1.3 28.09,32.78 C69.1
PH1-OSC_OUT
  Top 0.152: C70.1 25.97,35.61 X1.1 25.97,33.8 26.43,33.34 26.43,32.21 25.97,31.75 25.97,30.46 U16.24
PI_BOOT0
  Bottom 0.254: J7.5 22.48,42.67 22.48,50.12 U1.13
PI_NRST
  Bottom 0.254: U1.11 21.11,43.98 19.18,42.04 19.18,39.5 19.81,38.86 J7.6
POT_SHDN
  Top 0.152: U17.13 52.45,42.16 52.45,42.93 53.98,44.45 58.93,44.45 60.07,43.31 IC1.12 60.71,41.11 60.71,40.26 R20.1
POT_WP
  Top 0.152: R21.1 58.67,41.62 IC1.11 58.8,43.05 57.78,44.07 54.74,44.07 53.3,42.63 U17.12
R_EN
  Top 0.152: U1.36 52.85,52.58 54.74,52.58 55.5,51.82 55.5,50.42 56.77,49.15 64.77,49.15 65.28,49.66 R22.2 R3.2
R_OUT  (via drill 0.35)
  Top 0.152: IC1.6 56.26,48.01 56.33,48.07 | 56.33,48.07 57.12,48.87 63.37,48.87 65.02,47.22 65.02,46.86 65.53,46.35 66.8,46.35 68.33,47.88 71.18,47.88 K1.3 | U17.6 51.18,38.33 51.18,37.72 51.69,37.21 52.58,37.21 54.65,39.28 | 54.65,39.28 56.26,40.89 IC1.9 v56.26,43.31 | U17.9 54.65,39.28 | v56.26,48.64 56.33,48.58 56.33,48.07
  Bottom 0.152: v56.26,43.31 v56.26,48.64
RST_DRIVE  (via drill 0.35)
  Top 0.152: v37.85,42.16 37.85,41.91 37.08,41.15 R34.2 R35.1
  Bottom 0.152: IC4.8 36.89,43.12 v37.85,42.16
SPI_CLK_HV
  Top 0.152: IC1.2 61.34,45.72 60.58,44.96 50.25,44.96 Q2.3 49.49,44.2 R7.1 49.15,41.66 U17.1
SPI_CLK_LV
  Top 0.152: Q2.2 49.66,47.42 R6.1 48.51,48.26 46.61,50.16 37.49,50.16 U1.23
SPI_CS_HV  (via drill 0.35)
  Top 0.152: IC1.1 62.61,48.01 62.23,48.39 60.96,48.39 60.71,48.13 60.71,45.97 60.2,45.47 50.71,45.47 50.65,45.53 47.01,45.53 Q1.3 45.68,44.2 R5.1 46.12,44.2 v46.35,43.96 | v50.42,43.56 50.46,43.52 U17.16
  Bottom 0.152: v46.35,43.96 50.02,43.96 v50.42,43.56
SPI_CS_LV  (via drill 0.35)
  Top 0.152: Q1.2 45.85,47.42 R4.1 45.34,48.26 v44.58,49.02
  Bottom 0.152: v44.58,49.02 39.5,49.02 37.72,50.8 37.72,52.58 36.46,53.84 U1.24
SPI_MISO_HV  (via drill 0.35)
  Top 0.152: R11.1 41.87,44.2 Q4.3 42.76,45.09 v43.81,45.09 | v61.21,43.31 61.34,43.18 IC1.13 | U17.14 51.76,43.63 v51.94,43.81
  Bottom 0.152: v43.81,45.09 50.67,45.09 v51.94,43.81 53.21,42.55 60.45,42.55 v61.21,43.31
SPI_MISO_LV
  Top 0.152: Q4.2 42.04,47.42 R10.1 41.53,48.26 40.01,49.78 35.18,49.78 33.81,51.15 U1.21
SPI_MOSI_HV  (via drill 0.35)
  Top 0.152: R9.1 38.06,44.2 Q3.3 39.16,44.87 v40.01,45.72 40.13,45.85 59.82,45.85 60.2,46.23 60.2,47.02 IC1.3 | U17.2 47.43,40.58 v47.37,40.64
  Bottom 0.152: v40.01,45.72 42.29,43.43 44.83,43.43 47.37,40.89 v47.37,40.64
SPI_MOSI_LV
  Top 0.152: Q3.2 38.23,47.42 R8.1 37.08,49.4 34.19,49.4 32.29,51.3 U1.19
SWCLK  (via drill 0.35)
  Top 0.254: U16.109 38.11,10.94 v38.1,10.92 | v10.92,10.92 5.59,10.92 J1.2
  Bottom 0.254: v38.1,10.92 v10.92,10.92
SWDIO  (via drill 0.35)
  Top 0.254: U16.105 v35.83,10.28 v35.81,10.29 | v10.41,10.29 3.81,10.29 1.78,12.32 1.78,13.97 J1.4
  Bottom 0.254: v35.81,10.29 v10.41,10.29
SWO-SWIM
  Top 0.152: J2.1 7.62,24.64 7.62,17.27 J1.3
USB_DN  (via drill 0.35)
  Top 0.152: J6.D- 67.24,9.29 66.55,8.59 65.25,8.59 64.76,9.08 U2.3
  Top 0.254: U2.3 61.27,9.08 v61.21,9.14 | v34.67,7.11 34.67,8 34.83,8.15 U16.103
  Bottom 0.152: v34.67,7.11 57.02,7.11 59.05,9.14 v61.21,9.14
USB_DP  (via drill 0.35)
  Top 0.152: J6.D+ 66.73,11.29 66.55,11.48 63.88,11.48 63.48,11.07 U2.1
  Top 0.254: U16.104 35.31,9.04 v35.31,7.75 | v61.34,11.05 63.45,11.05 63.48,11.07
  Bottom 0.152: v35.31,7.75 56.39,7.75 59.69,11.05 v61.34,11.05
USB_ID
  Top 0.152: U16.102 34.33,8.29 33.72,7.68 33.66,7.62 33.53,7.49 TP3.TP
USB_LOAD_SWITCH
  Top 0.152: U16.75 TP1.TP
VBAT
  Top 0.254: U16.6 34.83,33.16 | 34.83,33.16 C61.1 | JP4.2 34.11,33.73 34.68,33.16 34.83,33.16
VCAP
  Top 0.152: U16.71 18.79,11.44 18.8,11.43 19.18,11.81 19.18,12.7 19.43,12.95 34.8,12.95 36.33,11.43 U16.106
  Top 0.254: U16.71 15.12,11.44 C50.1 | U16.106 C48.1
VDDA
  Top 0.152: U16.33 21.32,30.95 21.08,31.2 19.26,31.2 18.67,30.61 17.53,30.61 17.27,30.86 17.27,31.77
  Top 0.254: C67.1 C66.1 | JP3.2 15.54,31.77 17.27,31.77
  Top 0.381: C66.1 17.27,33.39 17.27,31.77 JP2.1
VHAX  (via drill 0.35)
  Top 0.152: Q11.2 30.46,42.78 30.73,43.05 30.72,43.07 30.72,43.18 | 30.72,43.18 30.72,44.25 30.27,44.7 v28.83,44.7 | 30.72,43.18 33.27,43.18 33.27,45.09 34.92,45.09 35.69,45.85 35.69,47.5 35.18,48.01 33.66,48.01 R26.2 | v29.34,36.7 28.57,36.7 28.19,37.08 R36.1
  Top 0.254: IC3.4 26.42,44.63 v26.42,43.69 | IC3.8 32.65,49.02 33.66,48.01
  Bottom 0.152: 29.08,36.2 29.08,36.45 v29.34,36.7 | IC2.16 29.08,32.38 30.1,31.37 C4.1
  Bottom 0.254: JP6.2 25.68,44.7 | 25.68,44.7 25.68,44.42 v26.42,43.69 27.69,42.42 27.69,37.34 28.83,36.2 29.08,36.2 IC2.16 | IC4.14 29.08,44.45 v28.83,44.7 25.68,44.7
VIN
  Top 0.152: R37.2 75.44,38.22 J11.2 | J13.B9 75.78,27.53 | J13.B4 75.78,30.03
  Top 0.254: 75.78,30.03 J13.A9 | 75.78,27.53 J13.A4
  Bottom 0.508: J13.B9 75.8,27.54 75.41,27.54 75,27.96 75,29.98 | 75,29.98 75.09,30.07 73.66,31.5 73.66,33.4 75.44,35.18 J11.2 | 75,29.98 J13.B4
VOLT_S  (via drill 0.35)
  Top 0.152: U16.49 15.2,22.44 TP5.TP 14.99,22.23 13.84,22.23 12.16,20.55 12.16,10.47 9.02,7.32 v9.02,3.56 | R38.2 R37.1 73.8,39.25 74.42,39.88 v75.69,39.88 75.69,39.86 76.19,39.37 C3.1 | v57.09,2.99 57.09,4.64 60.58,8.13 60.58,14.22 61.72,15.37 72.39,15.37 v74.3,13.46
  Bottom 0.152: v9.02,3.56 11.3,1.27 55.24,1.27 57.02,3.05 v57.09,2.99 | v74.3,13.46 75.06,13.46 83.57,21.97 83.57,37.72 81.41,39.88 v75.69,39.88
VREFP
  Top 0.152: U16.32 21.82,31.26 21.61,31.48 20.79,31.48 20.14,32.13 20.07,32.13 | C58.1 20.19,32.4 C65.1
  Top 0.254: 20.07,32.13 C58.1 | C64.1 C65.1
  Top 0.381: JP2.2 18.44,32.13 C58.1

## Text on the board
tNames: GND | GND | GND
Document: Pi | Pi | USB | Board | 5V | BOOT | 3.3V | RST | Pi | Board | CIRCLES mattHat v1.1
tDocu: ACC Armed | Panda Status | Oct 24 2022
bDocu: Project: https://circles-consortium.github.io | Support: https://github.com/jmscslgroup/libpanda | matthew.r.bunting@vanderbilt.edu